# EAGLE design NixiTubeClock (EAGLE 9.5.1)

## Sheet 1 of 3
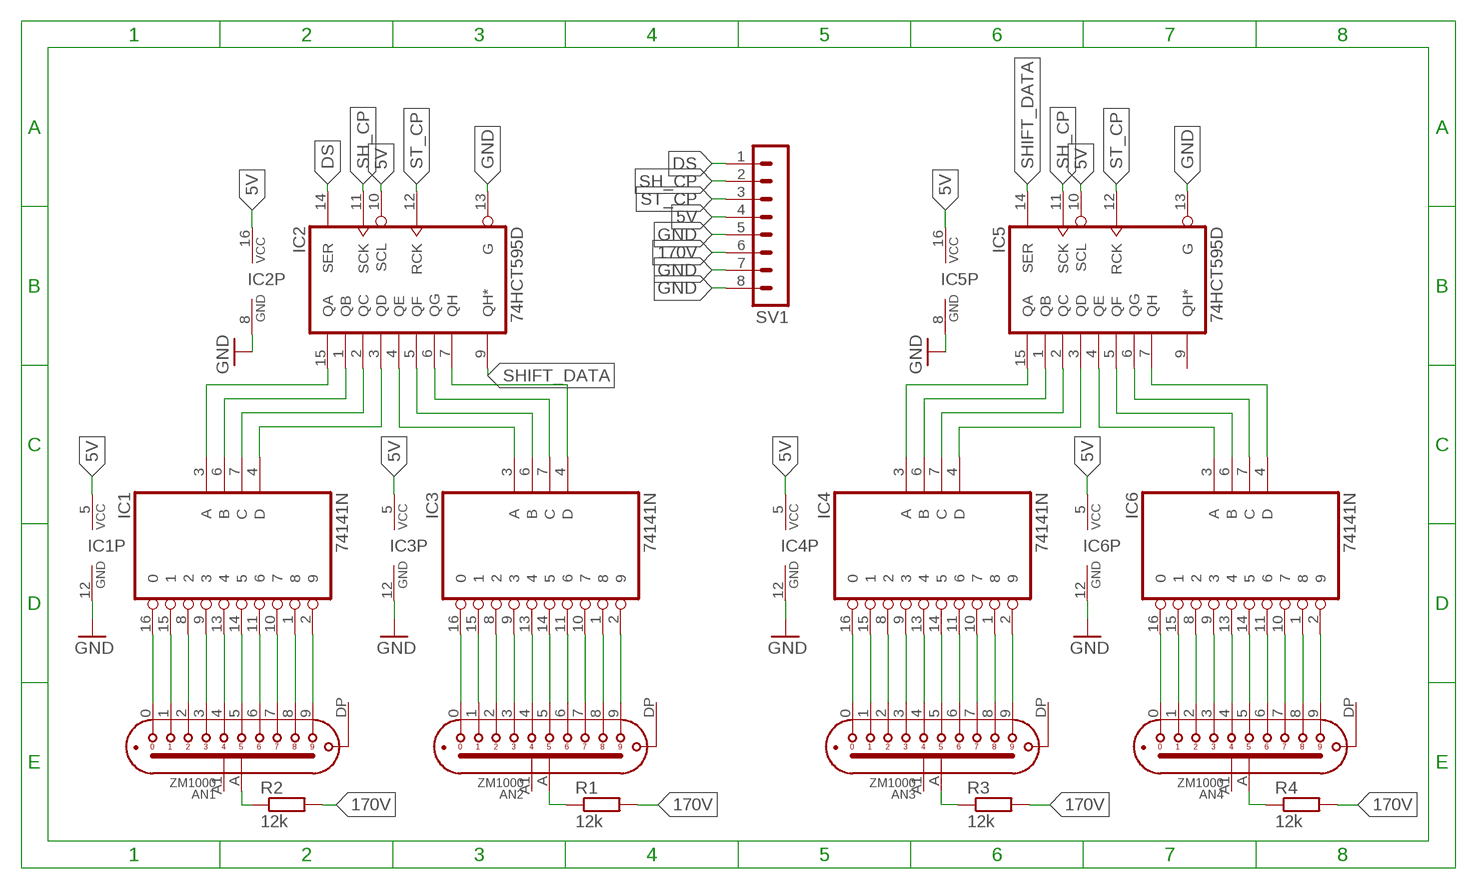
[diagram p0: schematic, sheet 1]

### Parts
AN1  ZM1000  [ZM1000]
AN2  ZM1000  [ZM1000]
AN3  ZM1000  [ZM1000]
AN4  ZM1000  [ZM1000]
IC1  74141N  [DIL16]
IC2  74HCT595D  [SO16]
IC3  74141N  [DIL16]
IC4  74141N  [DIL16]
IC5  74HCT595D  [SO16]
IC6  74141N  [DIL16]
R1  12k  R-EU_1206R1206  [R1206]
R2  12k  R-EU_1206R1206  [R1206]
R3  12k  R-EU_1206R1206  [R1206]
R4  12k  R-EU_1206R1206  [R1206]
SV1  MA08-1  [MA08-1]

### Nets
5V: IC1.5(VCC) IC2.10(SCL) IC2.16(VCC) IC3.5(VCC) IC4.5(VCC) IC5.10(SCL) IC5.16(VCC) IC6.5(VCC) SV1.4
170V: R1.2 R2.2 R3.2 R4.2 SV1.6
DS: IC2.14(SER) SV1.1
GND: IC1.12(GND) IC2.8(GND) IC2.13(G) IC3.12(GND) IC4.12(GND) IC5.8(GND) IC5.13(G) IC6.12(GND) SV1.5 SV1.7 SV1.8
N$1: IC4.4(D) IC5.3(QD)
N$7: AN1.0 IC1.16
N$9: AN1.1 IC1.15
N$13: AN1.2 IC1.8
N$15: AN1.3 IC1.9
N$16: AN1.4 IC1.13
N$17: AN1.5 IC1.14
N$18: AN1.6 IC1.11
N$19: AN1.7 IC1.10
N$20: AN1.8 IC1.1
N$21: AN1.9 IC1.2
N$22: AN2.0 IC3.16
N$23: AN2.1 IC3.15
N$24: AN2.2 IC3.8
N$25: AN2.3 IC3.9
N$26: AN2.4 IC3.13
N$27: AN2.5 IC3.14
N$28: AN2.6 IC3.11
N$29: AN2.7 IC3.10
N$30: AN2.8 IC3.1
N$31: AN2.9 IC3.2
N$32: AN3.0 IC4.16
N$35: AN3.1 IC4.15
N$36: AN3.2 IC4.8
N$66: AN3.3 IC4.9
N$67: AN3.4 IC4.13
N$68: AN3.5 IC4.14
N$69: AN3.6 IC4.11
N$70: AN3.7 IC4.10
N$71: AN3.8 IC4.1
N$72: AN3.9 IC4.2
N$73: AN4.0 IC6.16
N$74: AN4.1 IC6.15
N$75: AN4.2 IC6.8
N$76: AN4.3 IC6.9
N$91: AN4.4 IC6.13
N$92: AN4.5 IC6.14
N$93: AN4.6 IC6.11
N$94: AN4.7 IC6.10
N$95: AN4.8 IC6.1
N$96: AN4.9 IC6.2
N$97: AN1.A(A1) R2.1
N$98: AN2.A(A1) R1.1
N$99: AN3.A(A1) R3.1
N$100: AN4.A(A1) R4.1
N$101: IC1.3(A) IC2.15(QA)
N$102: IC1.6(B) IC2.1(QB)
N$103: IC1.7(C) IC2.2(QC)
N$104: IC1.4(D) IC2.3(QD)
N$105: IC2.4(QE) IC3.3(A)
N$106: IC2.5(QF) IC3.6(B)
N$107: IC2.6(QG) IC3.7(C)
N$108: IC2.7(QH) IC3.4(D)
N$109: IC4.3(A) IC5.15(QA)
N$110: IC4.6(B) IC5.1(QB)
N$111: IC4.7(C) IC5.2(QC)
N$113: IC5.4(QE) IC6.3(A)
N$114: IC5.5(QF) IC6.6(B)
N$115: IC5.6(QG) IC6.7(C)
N$116: IC5.7(QH) IC6.4(D)
SH_CP: IC2.11(SCK) IC5.11(SCK) SV1.2
SHIFT_DATA: IC2.9(QH*) IC5.14(SER)
ST_CP: IC2.12(RCK) IC5.12(RCK) SV1.3
Unconnected: AN1.A1(A2) AN1.DP(DPL) AN2.A1(A2) AN2.DP(DPL) AN3.A1(A2) AN3.DP(DPL) AN4.A1(A2) AN4.DP(DPL) IC5.9(QH*)

## Sheet 2 of 3
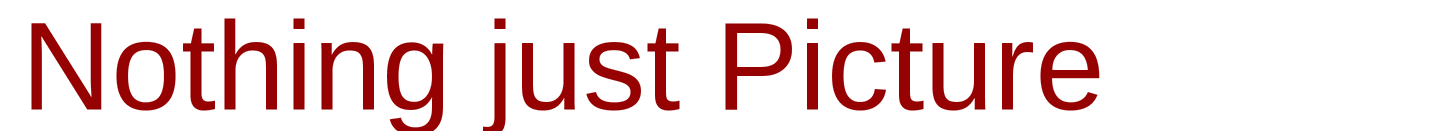
[diagram p1: schematic, sheet 2]

### Notes on the sheet
- Nothing just Picture

## Sheet 3 of 3

## Library data of the parts
AN1-AN4 = NixieTube:ZM1000: Indicator Tube (numeral height 14mm, no filter, side view, long-life typ)
IC1 IC3 IC4 IC6 = NixieTube:74*141: BCD to decimal DECODER/DRIVER
IC2 IC5 = NixieTube:74*595: 8-bit SHIFT REGISTER, output latch
R1-R4 = CommonParts:R-EU_1206: RESISTOR, European symbol
SV1 = con-lstb:MA08-1: PIN HEADER; OC_FARNELL: unknown; OC_NEWARK: unknown

## Net classes
0 default: width 0.2 mm, drill 0.3 mm, clearance 0.1 mm
1 other: width 0.2 mm, drill 0.2 mm, clearance 0.1 mm

## Board
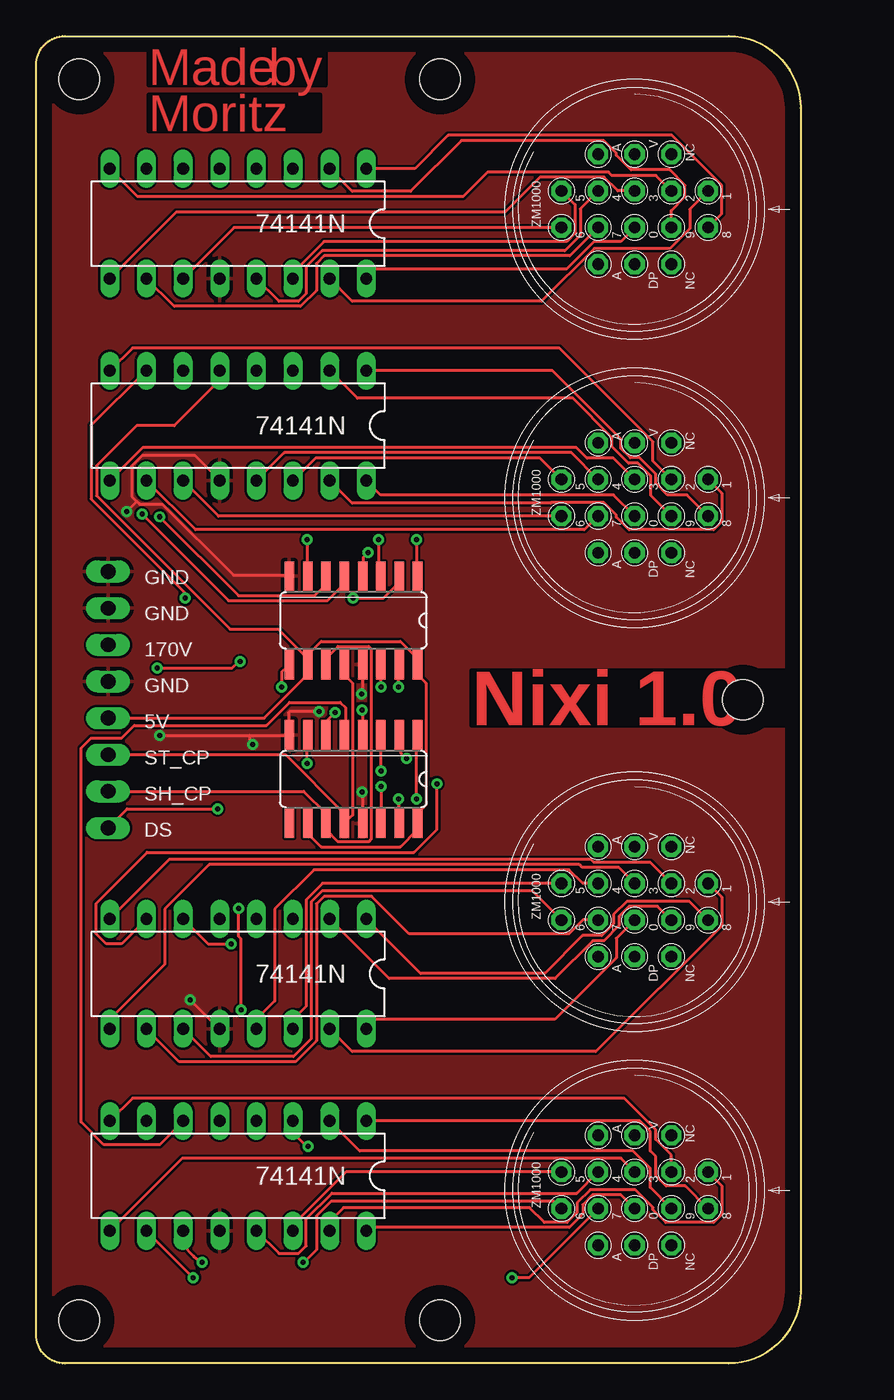
[diagram p2: board, top side]
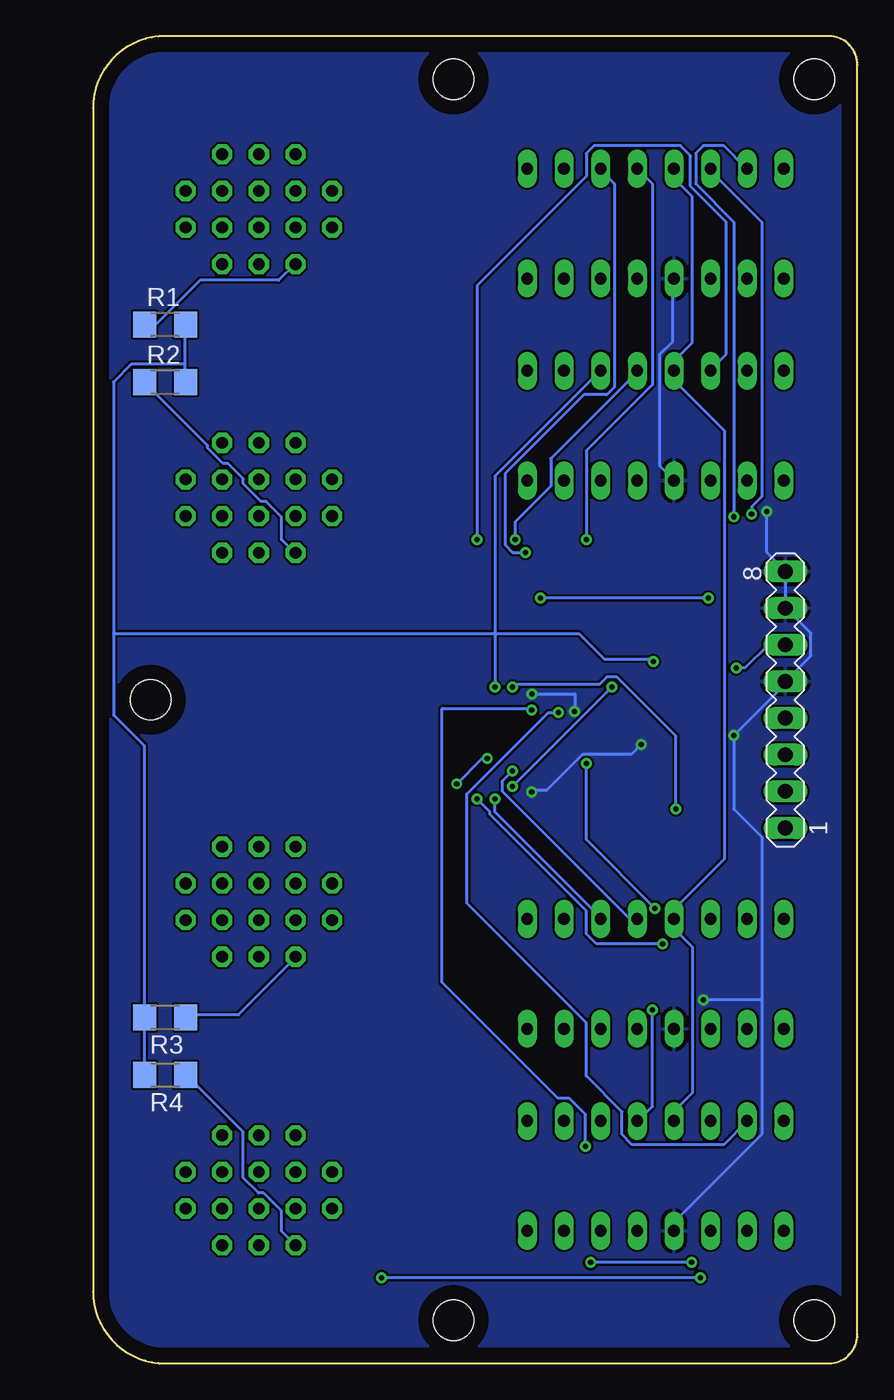
[diagram p3: board, bottom side, seen from below]

Size 53 x 92 mm. Coordinates in mm from the lower left corner, seen from the top.
Outline: 2,92 48,92 arc-90 53,87 53,5 arc-90 48,0 2,0 arc-90 0,2 0,90 arc-90 2,92
Copper layers (1*16): Top 0.035mm / dielectric 1.5mm / Bottom 0.035mm
Design rules "default": minimum track width 6mil, minimum drill 0.35mm, track to track 6mil, track to pad 6mil, pad to pad 6mil, via to via 6mil, smd to smd 6mil, copper to edge 40mil, drill to drill 6mil, minimum pad ring 10mil, minimum via ring 8mil, stop-mask expansion 4mil, vias tented up to drill 0mil, thermal gap 10mil
Holes 2.8 mm at 3,89 28,89 28,3 3,3 49,46

### Footprints (pad centres in the part's own frame; a part is rotated, then mirrored left to right if it is on the bottom)
ZM1000 = drill 0.813 pad 1.397 octagon: 0 -1.27,0; 1 1.27,-5.08; 2 1.27,-2.54; 3 1.27,0; 4 1.27,2.54; 5 1.27,5.08; 6 -1.27,5.08; 7 -1.27,2.54; 8 -1.27,-5.08; 9 -1.27,-2.54; A -3.81,2.54; A1 3.81,2.54; DP -3.81,0; NC1 3.81,-2.54; NC2 -3.81,-2.54; V 3.81,0
DIL16 = drill 0.813 long: 1 -8.89,-3.81; 2 -6.35,-3.81; 3 -3.81,-3.81; 4 -1.27,-3.81; 5 1.27,-3.81; 6 3.81,-3.81; 7 6.35,-3.81; 8 8.89,-3.81; 9 8.89,3.81; 10 6.35,3.81; 11 3.81,3.81; 12 1.27,3.81; 13 -1.27,3.81; 14 -3.81,3.81; 15 -6.35,3.81; 16 -8.89,3.81
SO16 = smd 0.66 x 2.032: 1 -4.445,-3.073; 2 -3.175,-3.073; 3 -1.905,-3.073; 4 -0.635,-3.073; 5 0.635,-3.073; 6 1.905,-3.073; 7 3.175,-3.073; 8 4.445,-3.073; 9 4.445,3.073; 10 3.175,3.073; 11 1.905,3.073; 12 0.635,3.073; 13 -0.635,3.073; 14 -1.905,3.073; 15 -3.175,3.073; 16 -4.445,3.073
R1206 = smd 1.6 x 1.803: 1 -1.422,0; 2 1.422,0
MA08-1 = drill 1.016 long: 1 -8.89,0; 2 -6.35,0; 3 -3.81,0; 4 -1.27,0; 5 1.27,0; 6 3.81,0; 7 6.35,0; 8 8.89,0

### Placement (x,y rotation side)
AN1  41.5,60 90 top
AN2  41.5,80 90 top
AN3  41.5,32 90 top
AN4  41.5,12 90 top
IC1  14,65 180 top
IC2  22,51.5 180 top
IC3  14,79 180 top
IC4  14,27 180 top
IC5  22,40.5 180 top
IC6  14,13 180 top
R1  48,72 0 bottom
R2  48,68 0 bottom
R3  48,24 180 bottom
R4  48,20 180 bottom
SV1  5,46 90 bottom

### Tracks (layer width: path | path; a pad name or v marks a point on that pad's centre or on a via)
5V
  Top 0.2: IC5.10 18.82,36.74 19.76,35.81 25.26,35.81 26.45,36.99 IC5.16 26.45,38.11 27.03,38.7 27.03,47.16 26.45,47.74 IC2.16 26.45,48.86 25.26,50.05 19.76,50.05 18.82,49.11 IC2.10 | IC1.5 12.73,68.15 9.58,65 6.97,65 4.2,62.23 4.2,60.15 13.45,50.9 16.79,50.9 18.82,48.86 IC2.10 | SV1.4 15.81,44.73 18.82,47.74 IC2.10
  Bottom 0.2: IC3.5 12.73,82.15 11.46,80.88 11.46,70.74 12.73,69.47 IC1.5 12.73,68.15 9.25,64.67 9.25,34.95 12.73,31.47 IC4.5 12.73,30.15 11.46,28.88 11.46,18.74 12.73,17.47 IC6.5
170V  (via drill 0.35)
  Top 0.2: v8.4,48.2 13.6,48.2 14.1,48.7 v14.15,48.65
  Bottom 0.2: SV1.6 6.19,49.81 7.8,48.2 v8.4,48.2 | R4.2 49.45,20.09 49.45,23.97 R3.2 49.45,24.14 49.45,42.82 51.57,44.94 51.57,50.57 | 46.64,69.25 46.64,71.89 R1.2 | 46.64,69.25 46.64,68.02 R2.2 | 51.57,50.57 51.57,68.02 50.34,69.25 46.64,69.25 | 51.57,50.57 19.32,50.57 17.56,48.81 14.21,48.81 v14.15,48.65
DS  (via drill 0.35)
  Top 0.2: v23.91,46.87 23.91,48.28 IC2.14 | v12.59,38.45 6.32,38.45 5.05,37.18 SV1.1
  Bottom 0.2: v23.91,46.87 23.71,47.07 17.89,47.07 17.39,47.58 16.68,47.58 12.59,43.48 v12.59,38.45
GND  (via drill 0.35)
  Top 0.2: 6.99,59.74 6.64,60.09 6.64,62.2 7.34,62.91 11.04,62.91 12.63,61.32 IC1.12 | 6.99,59.74 7.17,59.56 8.75,59.56 13.69,54.63 17.39,54.63 IC2.8 | v8.58,43.53 14.8,43.53 | 14.8,43.53 17.39,43.53 IC5.8 17.5,43.63 17.5,45.1 17.59,45.19 v19.61,45.19 | v10.69,25.2 12.63,23.26 IC4.12 | v6.29,59.03 6.99,59.74 | IC2.13 22.64,46.4 v22.58,46.4 | 14.8,43.53 14.8,42.9 14.9,42.8 v15,42.9 | v22.59,39.6 22.64,39.55 IC5.13
  Bottom 0.2: 5,52.4 SV1.8 5.05,54.98 6.29,56.21 v6.29,59.03 | 5,52.4 SV1.7 | 5,52.4 3.22,50.62 3.22,49.05 SV1.5 4.88,47.23 v8.58,43.53 8.58,38.42 6.64,36.48 6.64,25.2 | IC3.12 12.8,75.07 12.8,70.84 13.69,69.96 13.69,62.2 12.8,61.32 IC1.12 | 6.64,25.2 6.64,15.86 12.63,9.87 12.63,9.34 IC6.12 | 6.64,25.2 v10.69,25.2 | v22.58,46.4 19.6,46.4 v19.6,45.2 v19.61,45.19 | v15,42.9 15.68,42.22 19.06,42.22 21.58,39.7 22.6,39.7 22.6,39.61 v22.59,39.6
  pour Top: -1,93 53,93 53,-1 -1,-1
  pour Bottom: -1,93 53,93 53,-1 -1,-1
N$1  (via drill 0.35)
  Top 0.2: v23.91,41.06 23.91,43.53 IC5.3
  Bottom 0.2: v23.91,41.06 24.61,40.35 24.61,39.65 15.8,30.84 15.27,30.84 IC4.4
N$7
  Top 0.2: AN1.0 40.04,60.19 23.89,60.19 IC1.16
N$9
  Top 0.2: AN1.1 47.53,60.32 47.53,58.34 46.97,57.78 41.11,57.78 40.23,58.66 40.23,58.8 39.35,59.68 35.73,59.68 35.66,59.62 21.92,59.62 IC1.15
N$13
  Top 0.2: AN1.2 42.77,62.54 42.77,63.88 36.27,70.38 6.68,70.38 IC1.8
N$15
  Top 0.2: AN1.3 40.02,62.74 38.2,62.74 37.47,63.47 7.39,63.47 IC1.9
N$16
  Top 0.2: AN1.4 37.11,63.12 17.2,63.12 IC1.13
N$17
  Top 0.2: AN1.5 34.93,62.76 19.38,62.76 IC1.14
N$18
  Top 0.2: AN1.6 12.65,58.73 IC1.11
N$19
  Top 0.2: AN1.7 38.01,57.78 11.06,57.78 IC1.10
N$20
  Top 0.2: AN1.8 45.12,60.19 43.77,60.19 42.96,61.01 42.96,61.65 41.84,62.77 41.19,62.77 40.55,63.42 40.55,64.06 35.8,68.81 IC1.1
N$21
  Top 0.2: AN1.9 42.61,60.16 42.61,61.51 41.71,62.4 41.06,62.4 39.93,63.53 39.93,64.18 37.23,66.89 22.27,66.89 IC1.2
N$22
  Top 0.2: AN2.0 40.53,77.76 38.69,77.76 36.78,75.85 23.55,75.85 IC3.16
N$23
  Top 0.2: AN2.1 45.31,80 45.31,78.66 43.92,77.27 38.7,77.27 35.04,73.62 21.92,73.62 IC3.15
N$24
  Top 0.2: AN2.2 42.98,82.33 39.92,82.33 39.68,82.57 31.3,82.57 29.61,80.88 7.04,80.88 IC3.8
N$25
  Top 0.2: AN2.3 40.33,81.27 39.38,82.22 34.93,82.22 32.5,79.79 9.71,79.79 IC3.9
N$26
  Top 0.2: AN2.4 37.72,80.03 37.72,78.19 36.65,77.12 19.83,77.12 18.72,76.01 18.72,74.15 18.19,73.62 16.84,73.62 IC3.13
N$27
  Top 0.2: AN2.5 37.37,80.32 37.37,78.34 36.79,77.75 19.96,77.75 17.81,75.6 IC3.14
N$28
  Top 0.2: AN2.6 13.73,78.73 IC3.11
N$29
  Top 0.2: AN2.7 36.99,76.76 19.97,76.76 19.44,76.23 19.44,74.37 18.33,73.26 9.58,73.26 IC3.10
N$30
  Top 0.2: AN2.8 47.53,79.68 47.53,81.66 44.08,85.11 28.56,85.11 26.26,82.81 IC3.1
N$31
  Top 0.2: AN2.9 44.04,79.9 44.99,80.85 44.99,81.66 43.93,82.72 41.24,82.72 40.23,83.73 40.23,83.89 39.35,84.76 29.49,84.76 25.97,81.24 21.92,81.24 IC3.2
N$32
  Top 0.2: AN3.0 40.23,29.46 40.23,28.11 35.97,23.85 23.55,23.85 IC4.16
N$35
  Top 0.2: AN3.1 47.53,32.32 47.53,30.34 38.81,21.62 21.92,21.62 IC4.15
N$36
  Top 0.2: AN3.2 42.58,34.73 38.67,34.73 38.48,34.93 9.23,34.93 IC4.8
N$66
  Top 0.2: AN3.3 40.39,34.38 37.85,34.38 37.66,34.57 12,34.57 8.92,31.49 8.92,27.66 5.11,23.85 IC4.9
N$67
  Top 0.2: AN3.4 37.9,33.27 36.94,34.22 19.27,34.22 16.54,31.49 16.54,25.12 15.27,23.85 IC4.13
N$68
  Top 0.2: AN3.5 19.86,33.27 18.72,32.13 18.72,24.76 17.81,23.85 IC4.14
N$69
  Top 0.2: AN3.6 34.41,32.74 19.83,32.74 19.08,31.99 19.08,22.51 17.84,21.27 12.11,21.27 IC4.11
N$70
  Top 0.2: AN3.7 37.9,30.73 36.94,29.78 25.87,29.78 23.27,32.38 19.97,32.38 19.44,31.85 19.44,22.37 17.98,20.91 9.93,20.91 IC4.10
N$71
  Top 0.2: AN3.8 45.28,32.03 40.96,32.03 40.04,31.11 40.04,30.46 39.23,29.65 37.88,29.65 35.26,27.03 26.67,27.03 IC4.1
N$72
  Top 0.2: AN3.9 43.09,31.68 41.11,31.68 40.42,31 40.42,30.35 39.37,29.3 38.59,29.3 35.97,26.68 24.48,26.68 IC4.2
N$73
  Top 0.2: AN4.0 40.55,11.68 38.57,11.68 37.9,11.01 37.9,10.36 36.96,9.43 22.89,9.43 IC6.16
N$74
  Top 0.2: AN4.1 47.53,12.32 47.53,10.34 46.97,9.78 43.65,9.78 42.77,10.66 42.77,10.8 41.54,12.03 38.42,12.03 37.51,11.12 37.51,10.47 36.81,9.78 35.24,9.78 34.22,10.8 21.3,10.8 20.35,9.85 IC6.15
N$75
  Top 0.2: AN4.2 44.04,14.44 42.96,15.52 42.96,16.19 40.77,18.38 6.68,18.38 IC6.8
N$76
  Top 0.2: AN4.3 40.55,14.22 10.14,14.22 IC6.9
N$91
  Top 0.2: AN4.4 37.49,11.8 20.51,11.8 18.72,10.01 18.72,8.15 18.19,7.62 16.84,7.62 IC6.13 15.27,8.53
N$92
  Top 0.2: AN4.5 21.48,13.27 17.81,9.6 IC6.14
N$93  (via drill 0.35)
  Top 0.2: AN4.6 35.9,11.25 20.46,11.25 19.44,10.23 19.44,7.87 18.57,7 v18.5,7 | IC6.11 10.19,8.19 10.94,7.44 11.12,7.26 11.38,7 v11.5,7
  Bottom 0.2: v11.5,7 v18.5,7
N$94  (via drill 0.35)
  Top 0.2: AN4.7 34.17,5.94 v33,5.94 | IC6.10 v10.9,5.94
  Bottom 0.2: v10.9,5.94 v33,5.94
N$95
  Top 0.2: AN4.8 45.01,12.3 43.66,12.3 42.96,13.01 42.96,14.35 42.58,14.73 42.58,16.07 41.84,16.81 IC6.1
N$96
  Top 0.2: AN4.9 42.58,12.19 42.58,13.54 41.38,14.73 22.43,14.73 IC6.2
N$97
  Bottom 0.2: R2.1 49.28,67.84 45.05,63.61 45.05,63.44 43.99,62.38 43.64,62.38 42.58,61.32 42.58,60.97 41.35,59.74 41,59.74 39.94,58.68 39.94,57.09 39.06,56.21 AN1.A
N$98
  Bottom 0.2: R1.1 49.28,72.07 48.57,72.07 45.58,75.07 40.12,75.07 39.06,76.12 AN2.A
N$99
  Bottom 0.2: R3.1 46.46,24.14 42.94,24.14 39.06,28.02 AN3.A
N$100
  Bottom 0.2: R4.1 46.46,19.91 42.58,16.04 42.58,12.87 41.53,11.81 41.17,11.81 39.94,10.58 39.94,9.17 39.06,8.29 AN4.A
N$101  (via drill 0.35)
  Top 0.2: v25.14,46.87 25.14,48.28 IC2.15
  Bottom 0.2: v25.14,46.87 25.14,61.5 17.91,68.72 IC1.3
N$102  (via drill 0.35)
  Top 0.2: v26.37,57.09 26.37,54.63 IC2.1
  Bottom 0.2: v26.37,57.09 26.37,74.71 18.8,82.29 18.8,83.88 18.27,84.4 12.28,84.4 11.57,83.7 11.57,81.58 9.11,79.12 9.11,69.96 10.16,68.9 IC1.6
N$103  (via drill 0.35)
  Top 0.2: v21.97,53.04 24.08,53.04 25.14,54.1 25.14,54.45 IC2.2 | v10.34,53.04 10.34,53.39 3.82,59.91 3.82,65.02 7.52,68.72 IC1.7
  Bottom 0.2: v10.34,53.04 v21.97,53.04
N$104  (via drill 0.35)
  Top 0.2: v23.73,57.09 23.73,54.63 IC2.3
  Bottom 0.2: v23.73,57.09 23.73,58.33 21.26,60.79 21.26,62.73 15.27,68.72 IC1.4
N$105  (via drill 0.35)
  Top 0.2: v23.02,56.21 22.67,55.86 22.67,54.63 IC2.4
  Bottom 0.2: v23.02,56.21 23.91,56.21 24.43,56.74 24.43,61.67 18.97,67.14 17.39,67.14 16.86,67.67 16.86,81.76 17.74,82.64 IC3.3
N$106  (via drill 0.35)
  Top 0.2: v7.34,58.85 13.33,52.87 20.21,52.87 21.26,53.92 21.26,54.45 IC2.5
  Bottom 0.2: v7.34,58.85 7.34,59.38 6.64,60.09 6.64,79.12 10.16,82.64 IC3.6
N$107  (via drill 0.35)
  Top 0.2: v8.58,58.68 14.04,53.22 19.32,53.22 20.03,53.92 20.03,54.45 IC2.6
  Bottom 0.2: v8.58,58.68 8.58,79.12 11.22,81.76 11.22,83.88 10.69,84.4 9.28,84.4 7.7,82.82 IC3.7
N$108  (via drill 0.35)
  Top 0.2: v18.8,57.09 18.8,54.63 IC2.7
  Bottom 0.2: v18.8,57.09 18.8,63.26 14.21,67.84 14.21,81.76 15.1,82.64 IC3.4
N$109  (via drill 0.35)
  Top 0.2: v25.14,39.12 25.14,37.53 IC5.15
  Bottom 0.2: v25.14,39.12 25.14,38.24 17.74,30.84 IC4.3
N$110  (via drill 0.35)
  Top 0.2: v26.37,39.12 26.37,43.53 IC5.1 | v13.51,29.08 11.92,29.08 10.34,30.66 IC4.6
  Bottom 0.2: v26.37,39.12 25.49,38.24 25.49,38.06 18.8,31.37 18.8,29.78 18.09,29.08 v13.51,29.08
N$111  (via drill 0.35)
  Top 0.2: v25.67,41.94 25.32,42.29 25.32,43.53 IC5.2 | v27.78,40.18 27.78,37.01 26.2,35.42 7.7,35.42 4.17,31.9 4.17,29.78 4.88,29.08 5.93,29.08 7.52,30.66 IC4.7
  Bottom 0.2: v25.67,41.94 26.02,41.94 v27.78,40.18
N$113  (via drill 0.35)
  Top 0.2: IC6.3 17.81,15.99 18.8,15 v18.85,15.05 | IC5.4 22.64,45.25 v22.59,45.3 | IC5.4 22.7,43.51 22.7,43 22.64,43.06 IC5.4
  Bottom 0.2: v18.85,15.05 18.85,17.26 19.97,18.38 20.78,18.38 28.8,26.4 28.8,45.4 22.7,45.4 v22.6,45.3 v22.59,45.3
N$114
  Top 0.2: IC5.5 21.44,43.7 21.44,45.46 21.09,45.82 17.56,45.82 15.98,44.23 6.82,44.23 5.93,43.35 3.82,43.35 3.11,42.65 3.11,16.74 4.7,15.16 8.58,15.16 10.16,16.74 IC6.6
N$115  (via drill 0.35)
  Top 0.2: v20.73,45.11 20.21,44.58 20.21,43.7 IC5.6
  Bottom 0.2: v20.73,45.11 21.44,45.11 27.08,39.47 27.08,31.9 18.8,23.61 18.8,19.91 16.33,17.45 16.33,15.86 15.62,15.16 9.28,15.16 7.7,16.74 IC6.7
N$116  (via drill 0.35)
  Top 0.2: v18.8,41.59 18.8,43.53 IC5.7 | v14.04,31.54 14.04,29.61 14.21,29.43 v14.21,24.5
  Bottom 0.2: v18.8,41.59 18.8,36.3 v14.04,31.54 | v14.21,24.5 14.21,17.8 15.1,16.92 IC6.4
SH_CP
  Top 0.2: SV1.2 18.56,39.65 20.09,38.11 IC5.11 20.09,36.99 20.93,36.16 23.07,36.16 23.22,36.31 23.22,49.55 23.07,49.7 20.93,49.7 20.09,48.86 IC2.11
SHIFT_DATA  (via drill 0.35)
  Top 0.2: v23.91,40 23.91,37.53 IC5.14 | v17.03,46.87 17.03,47.93 17.39,48.28 IC2.9
  Bottom 0.2: v17.03,46.87 v23.91,40
ST_CP
  Top 0.2: SV1.3 17.29,42.19 21.36,38.11 IC5.12 21.95,38.01 21.95,47.16 21.36,47.74 IC2.12

### Text on the board
Top: Made | by | Moritz | Nixi 1.0
tNames: GND | GND | 170V | GND | 5V | ST_CP | SH_CP | DS
tStop: Made | by | Moritz | Nixi 1.0
tKeepout: Made | by | Moritz | Nixi 1.0